# EAGLE design input amp w gp (EAGLE 6.5.0)
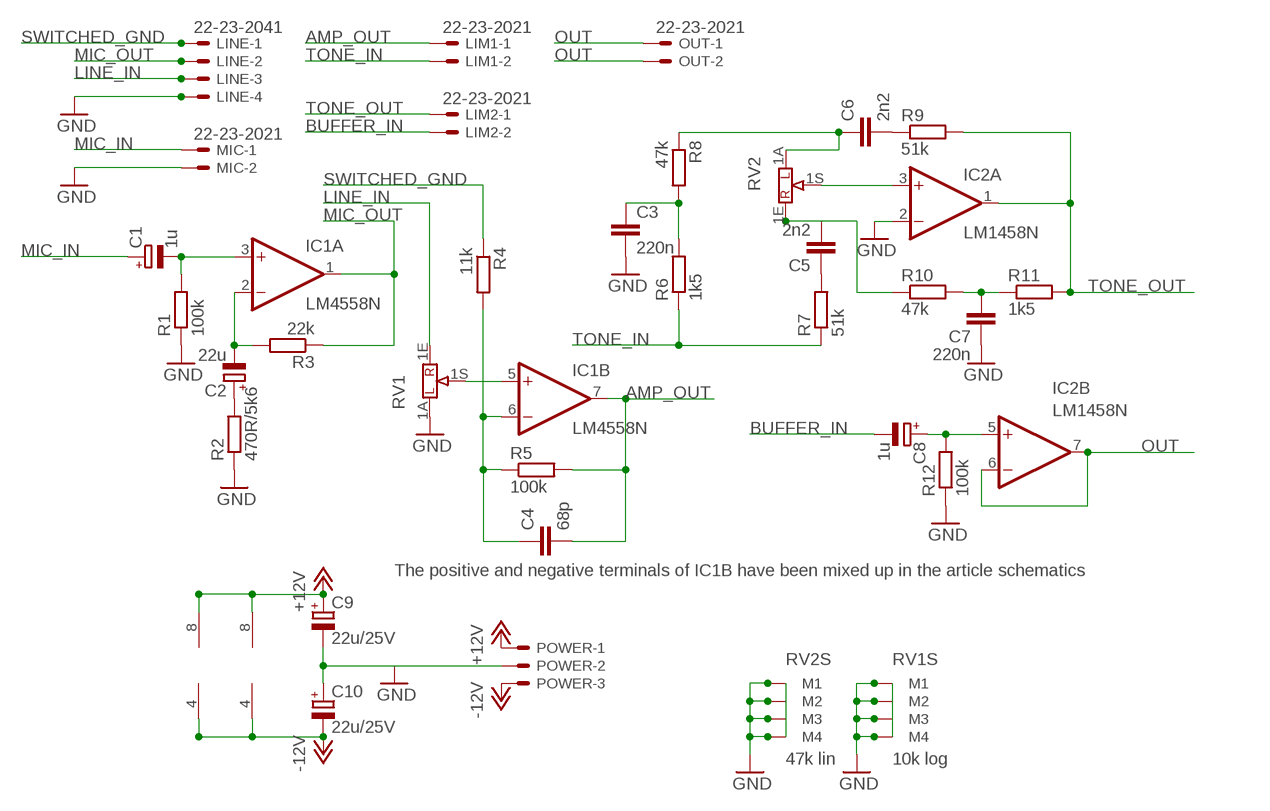
[diagram p0: schematic, sheet 1]

## Parts
C1  1u  CPOL-EUE2.5-5  [E2,5-5]
C2  22u  CPOL-EUE2.5-5  [E2,5-5]
C3  220n  C-EU050-025X075  [C050-025X075]
C4  68p  C-EU025-025X050  [C025-025X050]
C5  2n2  C-EU050-025X075  [C050-025X075]
C6  2n2  C-EU050-025X075  [C050-025X075]
C7  220n  C-EU050-025X075  [C050-025X075]
C8  1u  CPOL-EUE2.5-5  [E2,5-5]
C9  22u/25V  CPOL-EUE2.5-5  [E2,5-5]
C10  22u/25V  CPOL-EUE2.5-5  [E2,5-5]
IC1  LM4558N  [DIL08]
IC2  LM1458N  [DIL08]
LIM1  22-23-2021  [22-23-2021]
LIM2  22-23-2021  [22-23-2021]
LINE  22-23-2041  [22-23-2041]
MIC  22-23-2021  [22-23-2021]
OUT  22-23-2021  [22-23-2021]
POWER  KK-156-3  [KK-156-3]
R1  100k  R-EU_0207/7  [0207/7]
R2  470R/5k6  R-EU_0207/7  [0207/7]
R3  22k  R-EU_0207/7  [0207/7]
R4  11k  R-EU_0207/7  [0207/7]
R5  100k  R-EU_0207/7  [0207/7]
R6  1k5  R-EU_0207/7  [0207/7]
R7  51k  R-EU_0207/7  [0207/7]
R8  47k  R-EU_0207/7  [0207/7]
R9  51k  R-EU_0207/7  [0207/7]
R10  47k  R-EU_0207/7  [0207/7]
R11  1k5  R-EU_0207/7  [0207/7]
R12  100k  R-EU_0207/7  [0207/7]
RV1  10k log  POT16_W_BRACKET""  [POT16_W_BRACKET]
RV2  47k lin  POT16_W_BRACKET""  [POT16_W_BRACKET]

## Nets
+12V: C9.+ IC1.8(P:V+) IC2.8(P:V+) POWER.1
-12V: C10.- IC1.4(P:V-) IC2.4(P:V-) POWER.3
AMP_OUT: C4.2 IC1.7(B:OUT) LIM1.1 R5.2
BUFFER_IN: C8.- LIM2.2
GND: C3.2 C7.1 C9.- C10.+ IC2.2(A:-IN) LINE.4 MIC.2 POWER.2 R1.1 R2.1 R12.1 RV1.1A RV1.M1 RV1.M2 RV1.M3 RV1.M4 RV2.M1 RV2.M2 RV2.M3 RV2.M4
LINE_IN: LINE.3 RV1.1E
MIC_IN: C1.+ MIC.1
MIC_OUT: IC1.1(A:OUT) LINE.2 R3.1
N$1: C1.- IC1.3(A:+IN) R1.2
N$2: C2.- IC1.2(A:-IN) R3.2
N$3: IC2.3(A:+IN) RV2.1S
N$4: C2.+ R2.2
N$5: IC1.5(B:+IN) RV1.1S
N$6: C4.1 IC1.6(B:-IN) R4.2 R5.1
N$8: C3.1 R6.2 R8.2
N$9: C6.1 R8.1 RV2.1A
N$10: C5.2 R10.1 RV2.1E
N$11: C5.1 R7.2
N$13: C6.2 R9.1
N$14: C7.2 R10.2 R11.1
N$17: C8.+ IC2.5(B:+IN) R12.2
OUT: IC2.6(B:-IN) IC2.7(B:OUT) OUT.1 OUT.2
SWITCHED_GND: LINE.1 R4.1
TONE_IN: LIM1.2 R6.1 R7.1
TONE_OUT: IC2.1(A:OUT) LIM2.1 R9.2 R11.2

## Notes on the sheet
- The positive and negative terminals of IC1B have been mixed up in the article schematics

## Library data of the parts
C1 C2 C8-C10 = resistor:CPOL-EU: POLARIZED CAPACITOR, European symbol
C3-C7 = resistor:C-EU: CAPACITOR, European symbol
IC1 = linear:*4558: OP AMP
IC2 = linear:*1458: OP AMP
LIM1 LIM2 MIC OUT = con-molex:22-23-2021: .100" (2.54mm) Center Header - 2 Pin; MF: MOLEX; MPN: 22-23-2021; OC_FARNELL: 1462926; OC_NEWARK: 25C3832
LINE = con-molex:22-23-2041: .100" (2.54mm) Center Header - 4 Pin; MF: MOLEX; MPN: 22-23-2041; OC_FARNELL: 1462920; OC_NEWARK: 38C0355
POWER = con-molex:KK-156-3: KK 156 HEADER Source: http://www.molex.com/pdm_docs/sd/026604100_sd.pdf; OC_FARNELL: unknown; OC_NEWARK: unknown
R1-R12 = resistor:R-EU_: RESISTOR, European symbol
RV1 RV2 = joakim:POT16_W_BRACKET: POTENTIOMETER potentiometer, 16 mm w 5mm pitch and OMEG bracket, 17,8 x 7,5 mm

## Board
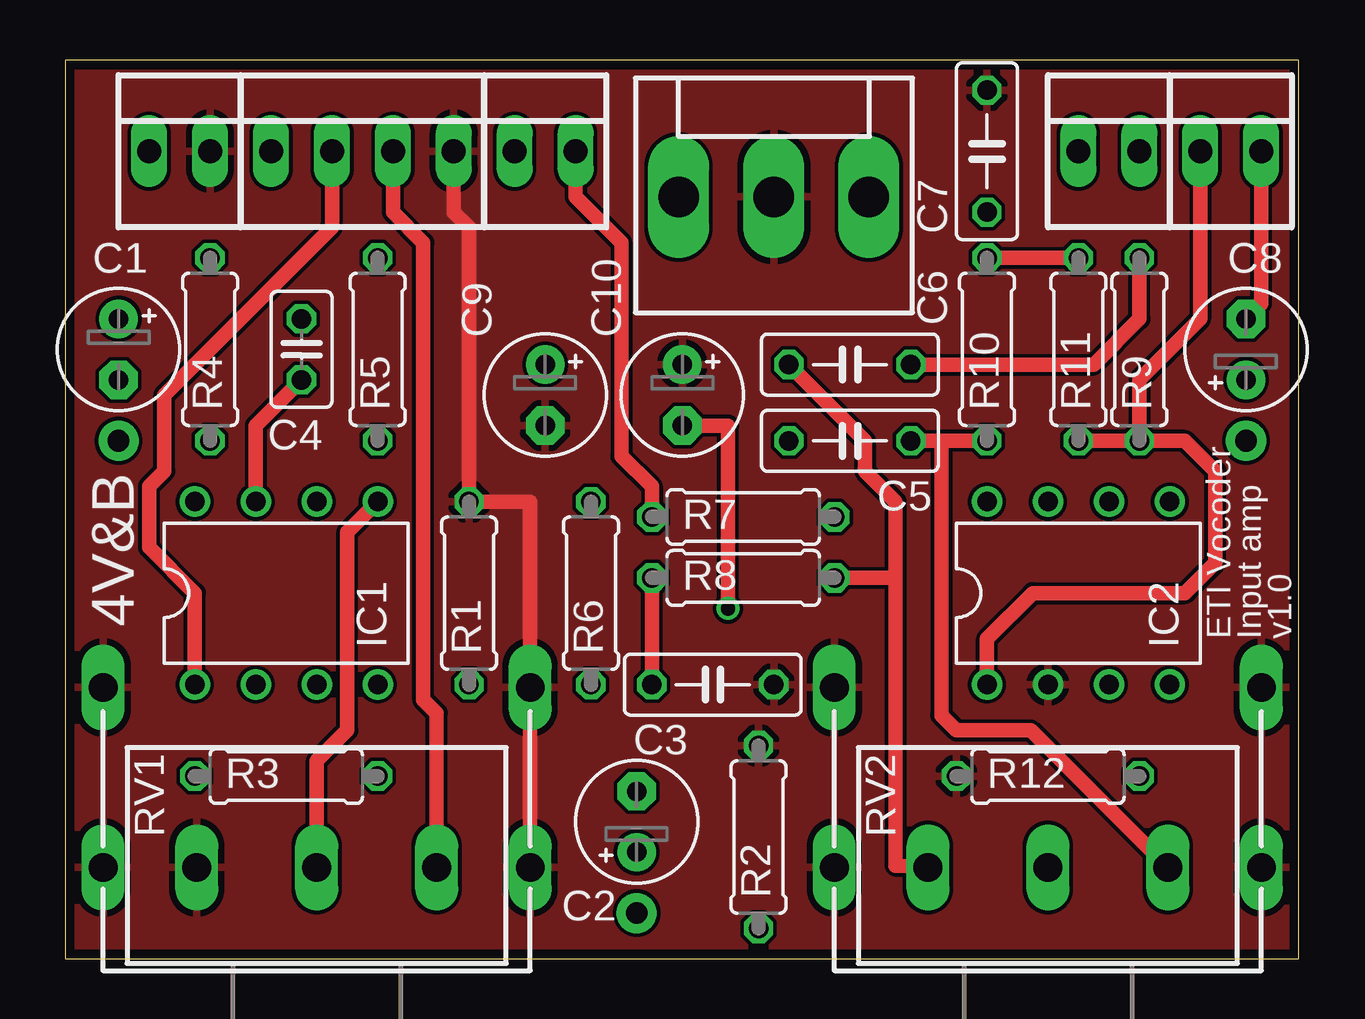
[diagram p1: board, top side]
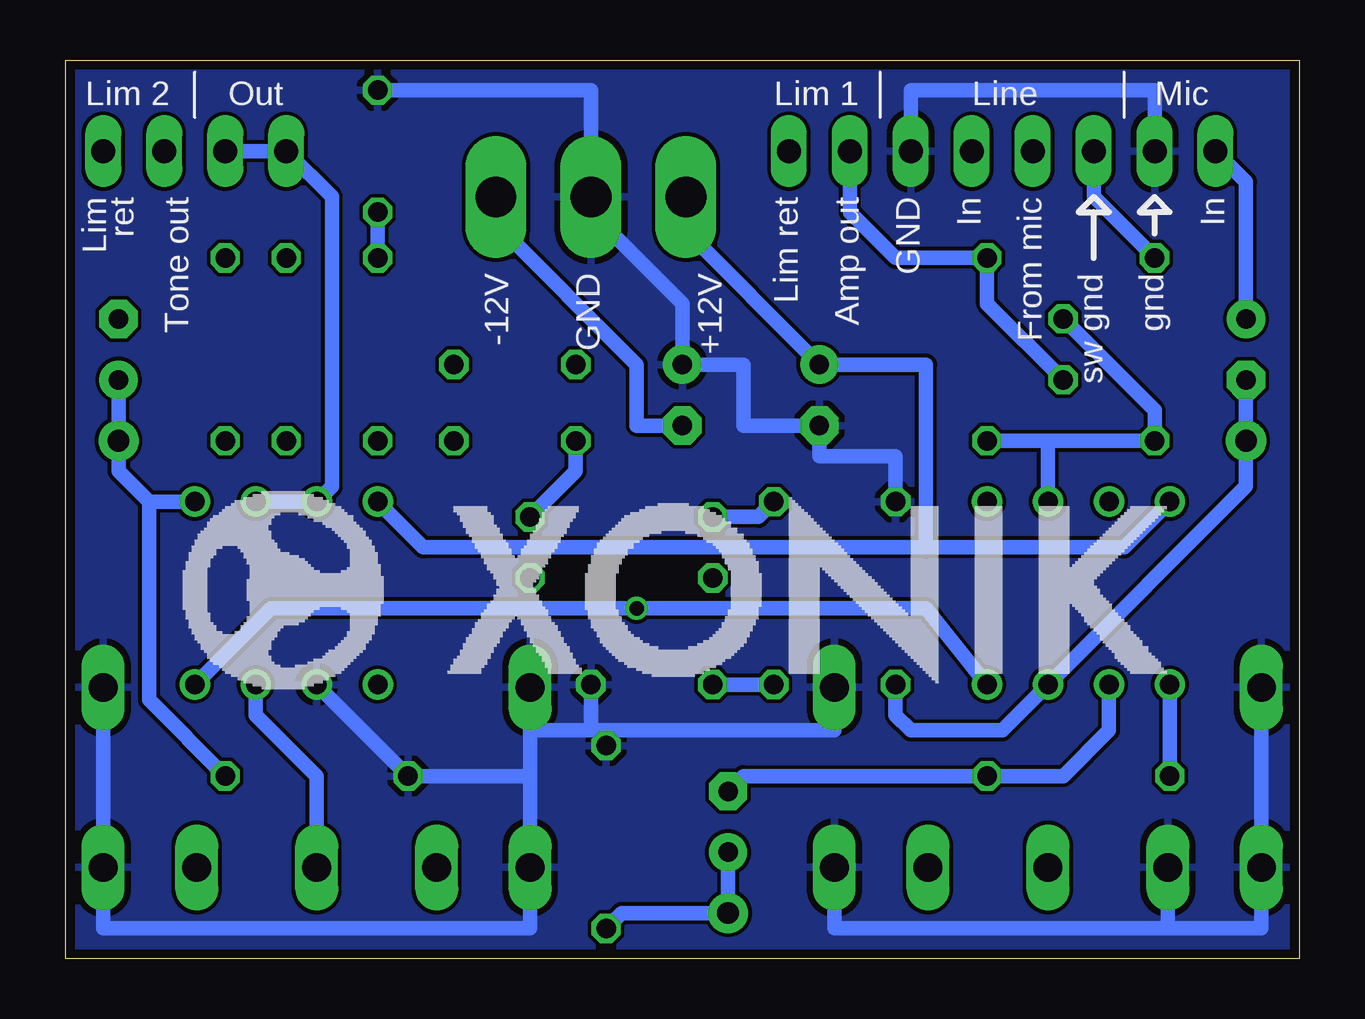
[diagram p2: board, bottom side, seen from below]

Size 51.42 x 37.45 mm. Coordinates in mm from the lower left corner, seen from the top.
Outline: 0,0 51.42,0 51.42,37.45 0,37.45 0,0
Copper layers (1*16): Top 0.0356mm / dielectric 1.5011mm / Bottom 0.0356mm
Design rules "oshpark-2layer": minimum track width 6mil, minimum drill 13mil, track to track 6mil, track to pad 6mil, pad to pad 6mil, via to via 6mil, smd to smd 6mil, copper to edge 15mil, drill to drill 6mil, minimum pad ring 7mil, minimum via ring 7mil, stop-mask expansion 2.5mil, vias tented up to drill 0mil, thermal gap 10mil

### Footprints (pad centres in the part's own frame; a part is rotated, then mirrored left to right if it is on the bottom)
E2,5-5 = drill 0.813 pad 1.6: + -1.27,0 | drill 0.813 pad 1.6 octagon: - 1.27,0
C050-025X075 = drill 0.813 octagon: 1 -2.54,0; 2 2.54,0
C025-025X050 = drill 0.813 octagon: 1 -1.27,0; 2 1.27,0
DIL08 = drill 0.813 pad 1.27: 1 -3.81,-3.81; 2 -1.27,-3.81; 3 1.27,-3.81; 4 3.81,-3.81; 5 3.81,3.81; 6 1.27,3.81; 7 -1.27,3.81; 8 -3.81,3.81
22-23-2021 = drill 1 long: 1 -1.27,0; 2 1.27,0
22-23-2041 = drill 1 long: 1 -3.81,0; 2 -1.27,0; 3 1.27,0; 4 3.81,0
KK-156-3 = drill 1.7 pad 2.184 long: 1 -3.96,0; 2 0,0; 3 3.96,0
0207/7 = drill 0.813 octagon: 1 -3.81,0; 2 3.81,0
POT16_W_BRACKET = drill 1.2 long: 1A -5,0; 1E 5,0; 1S 0,0; M1 -8.9,0; M2 8.9,0; M3 8.9,7.5; M4 -8.9,7.5

### Placement (x,y rotation side)
C1  2.22,25.4 270 top
C2  23.81,5.71 90 top
C3  26.99,11.43 0 top
C4  9.84,25.4 270 top
C5  32.7,21.59 0 top
C6  32.7,24.77 0 top
C7  38.42,33.66 270 top
C8  49.21,25.4 90 top
C9  20,23.5 270 top
C10  25.72,23.5 270 top
IC1  9.21,15.24 0 top
IC2  42.23,15.24 0 top
LIM1  20,33.66 0 top
LIM2  48.58,33.66 0 top
LINE  12.38,33.66 0 top
MIC  4.76,33.66 0 top
OUT  43.5,33.66 0 top
POWER  29.53,31.75 0 top
R1  16.83,15.24 270 top
R2  28.89,5.08 270 top
R3  9.21,7.62 0 top
R4  6.03,25.4 270 top
R5  13.02,25.4 90 top
R6  21.91,15.24 270 top
R7  28.26,18.41 0 top
R8  28.26,15.88 180 top
R9  44.77,25.4 270 top
R10  38.42,25.4 90 top
R11  42.23,25.4 270 top
R12  40.96,7.62 0 top
RV1  10.48,3.81 0 top
RV2  40.96,3.81 0 top

### Tracks (layer width: path | path; a pad name or v marks a point on that pad's centre or on a via)
+12V
  Bottom 0.61: IC1.8 7.3,17.14 15.56,17.14 | 15.56,17.14 36.51,17.14 IC2.8 | POWER.1 25.72,31.6 25.72,30.48 C9.+ 15.56,24.77 15.56,17.14
-12V  (via drill 0.6)
  Top 0.61: v27.62,14.61 27.62,22.23 C10.-
  Bottom 0.61: POWER.3 33.49,30.63 27.62,24.77 27.62,22.23 C10.- | IC1.4 15.56,14.61 v27.62,14.61 42.86,14.61 IC2.4
AMP_OUT
  Top 0.61: C4.2 7.94,22.23 IC1.7
  Bottom 0.61: LIM1.1 18.73,31.11 16.83,29.21 R5.2 13.02,27.3 C4.2
BUFFER_IN
  Top 0.61: C8.- 49.85,27.3 LIM2.2
GND
  Top 0.61: LINE.4 16.19,31.11 16.83,30.48 R1.1 19.37,19.05 19.38,19.04 RV1.M3 RV1.M2
  Bottom 0.61: RV1.M3 19.38,9.54 19.37,9.53 28.89,9.53 | 28.89,9.53 29.53,9.53 | 29.53,9.53 32.07,9.53 | 32.07,9.53 RV2.M4 | 32.06,7.62 RV2.M1 32.07,1.27 49.85,1.27 49.86,1.28 RV2.M2 RV2.M3 | 32.06,7.62 32.06,9.52 32.07,9.53 | 5.4,1.27 1.59,1.27 1.58,1.28 RV1.M1 RV1.M4 | 5.4,1.27 19.37,1.27 19.37,3.8 RV1.M2 | 32.06,7.62 R12.1 IC2.2 | RV1.1A 5.48,1.35 5.4,1.27 | C3.2 29.53,9.53 | R1.1 16.83,20.95 20,20.95 C9.- 23.18,22.23 23.18,24.77 C10.+ 25.72,27.3 29.53,31.11 POWER.2 29.53,36.2 C7.1 | R2.1 28.89,9.53 | LINE.4 16.19,36.2 6.03,36.2 MIC.2
  pour Top: -0.51,0.13 -0.51,38.1 -0.64,38.23 51.31,38.23 51.31,0.38 51.44,0.25 -0.38,0.25
  pour Bottom: 0.13,-0.64 0.13,37.08 0.25,37.21 51.82,37.21 51.82,-0.38 0.38,-0.38
LINE_IN
  Top 0.61: RV1.1E 15.48,10.24 14.92,10.79 14.92,29.84 13.65,31.11 LINE.3
MIC_IN
  Bottom 0.61: C1.+ 2.22,32.38 MIC.1
MIC_OUT
  Top 0.61: IC1.1 5.4,15.24 3.49,17.14 3.49,19.68 4.13,20.32 4.13,23.5 11.11,30.48 LINE.2
  Bottom 0.61: IC1.1 R3.1
N$1  (via drill 0.9 pad 1.68)
  Bottom 0.61: C1.- v2.22,21.59 2.22,19.68 IC1.3 12.38,9.53 16.19,9.53 16.83,10.16 R1.2
N$2
  Bottom 0.61: C2.- 23.18,7.62 R3.2 9.84,7.62 7.94,9.53 IC1.2
N$3
  Bottom 0.61: RV2.1S 40.96,7.62 43.5,10.16 IC2.3
N$4  (via drill 0.9 pad 1.68)
  Bottom 0.61: C2.+ v23.81,1.91 28.26,1.91 R2.2
N$5
  Top 0.61: RV1.1S 10.48,8.26 11.75,9.53 11.75,17.78 IC1.5
N$6
  Bottom 0.61: R5.1 10.48,21.59 | 10.48,21.59 R4.2 6.03,22.86 C4.1 | IC1.6 10.48,21.59
N$8
  Top 0.61: C3.1 R8.2
  Bottom 0.61: R6.2 C3.1
N$9
  Top 0.61: C6.1 33.34,21.59 33.34,20.32 34.61,19.05 34.61,15.88 | 34.61,15.88 34.61,3.89 RV2.1A | R8.1 34.61,15.88
N$10
  Top 0.61: R10.1 36.51,21.59 | C5.2 36.51,21.59 | 36.51,21.59 36.51,10.16 37.15,9.53 40.24,9.53 RV2.1E
N$11
  Bottom 0.61: R7.2 30.16,20.32 C5.1
N$13
  Top 0.61: C6.2 42.86,24.77 44.77,26.67 R9.1
N$14
  Top 0.61: R10.2 R11.1
  Bottom 0.61: C7.2 R10.2
N$17  (via drill 0.9 pad 1.68)
  Bottom 0.61: R12.2 47.94,10.79 47.94,19.05 | IC2.5 47.94,19.05 | 47.94,19.05 49.21,20.32 v49.21,21.59 C8.+
OUT
  Bottom 0.61: IC2.6 IC2.7 40.32,19.68 40.32,31.75 OUT.1 OUT.2
SWITCHED_GND
  Bottom 0.61: R4.1 8.57,31.75 LINE.1
TONE_IN
  Top 0.61: LIM1.2 21.27,31.75 23.18,29.84 23.18,20.95 24.45,19.68 R7.1
  Bottom 0.61: R6.1 22.54,18.41 R7.1
TONE_OUT
  Top 0.61: IC2.1 38.42,13.34 40.32,15.24 46.67,15.24 47.94,16.51 47.94,20.32 46.67,21.59 R9.2 | R9.2 R11.2 | LIM2.1 47.31,26.67 44.77,24.13 R9.2

### Text on the board
tNames: 4V&B | ETI Vocoder | Input amp | v1.0
bNames: Mic | Line | Lim 1 | Out | Lim 2 | In | From mic | In | GND | Amp out | Lim ret | Tone out | ret | Lim | gnd | sw gnd | +12V | GND | -12V